# Altium project PCB_Project_IGNIS-v5.PrjPcb
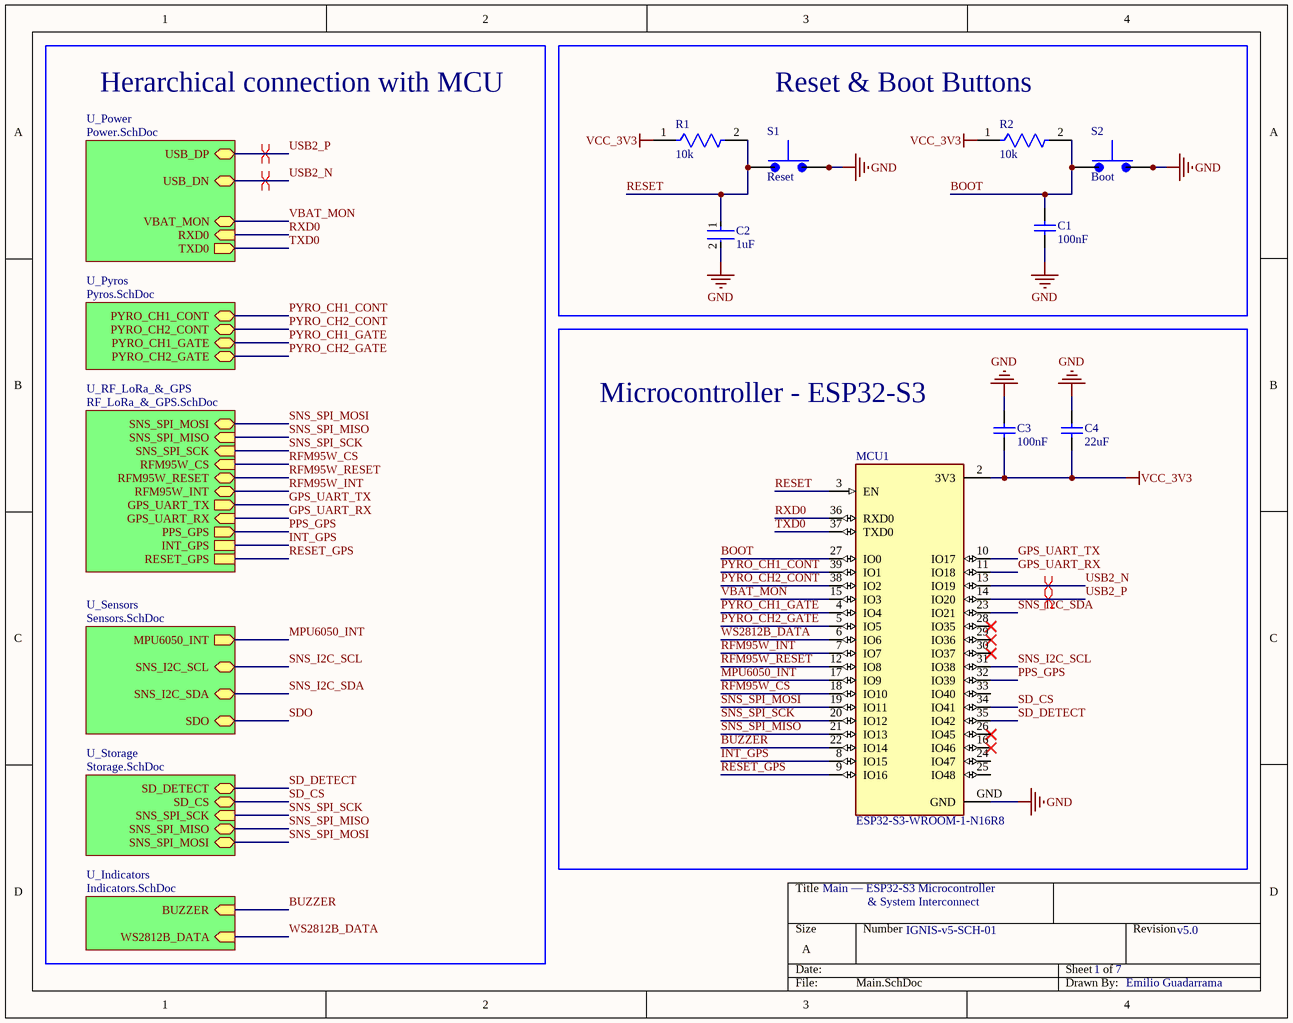
[diagram p0: Main.SchDoc]
7 sheets, 104 parts. Net scope: hierarchical (ports join the sheet entries above them; power ports are global).
Board file: PCB_IGNIS-v5.PcbDoc
Sheets:
  Main.SchDoc
    U_Pyros = Pyros.SchDoc
    U_Storage = Storage.SchDoc
    U_Indicators = Indicators.SchDoc
    U_RF_LoRa_&_GPS = RF_LoRa_&_GPS.SchDoc
    U_Power = Power.SchDoc
    U_Sensors = Sensors.SchDoc

## Sheet Main.SchDoc: Main — ESP32-S3 Microcontroller & System Interconnect
size A; DrawnBy: Emilio Guadarrama; SheetNumber: 1; SheetTotal: 7

### Parts
C1  100nF  [CAPC2013X145X50NL20T25]
C2  1uF  [FP-0805-L_2_01_0_2-W_1_25-MFG]
C3  100nF  [CAPC2013X145X50NL20T25]
C4  22uF  [CAPC0805(2012)145_L]
MCU1  ESP32-S3-WROOM-1-N16R8  [XCVR_ESP32-S3-WROOM-1-N16R2]
R1  10k  [FP-MCT0603-IPC_A]
R2  10k  [FP-MCT0603-IPC_A]
S1  Reset  [SW_SKRPABE010]
S2  Boot  [SW_SKRPABE010]

### Blocks framed on the sheet
Reset & Boot Buttons: C1 C2 R1 R2 S1 S2
Microcontroller - ESP32-S3: C3 C4 MCU1

### Sub-sheets
U_Indicators = Indicators.SchDoc: BUZZER (in), WS2812B_DATA (in)
U_Power = Power.SchDoc: RXD0 (in), TXD0 (out), VBAT_MON (bidir), USB_DP (bidir), USB_DN (bidir)
U_Pyros = Pyros.SchDoc: PYRO_CH2_CONT (bidir), PYRO_CH1_CONT (bidir), PYRO_CH2_GATE (bidir), PYRO_CH1_GATE (bidir)
U_RF_LoRa_&_GPS = RF_LoRa_&_GPS.SchDoc: SNS_SPI_MOSI (bidir), SNS_SPI_MISO (in), SNS_SPI_SCK (in), RFM95W_CS (in), RFM95W_RESET (bidir), RFM95W_INT (bidir), GPS_UART_TX (out), GPS_UART_RX (in), PPS_GPS (out), INT_GPS, RESET_GPS
U_Sensors = Sensors.SchDoc: MPU6050_INT (out), SNS_I2C_SCL (bidir), SNS_I2C_SDA (bidir), SDO (bidir)
U_Storage = Storage.SchDoc: SD_CS (bidir), SD_DETECT (bidir), SNS_SPI_MOSI (bidir), SNS_SPI_MISO (bidir), SNS_SPI_SCK (in)

### Nets
GND: C1.1 C2.2 C3.2 C4.2 MCU1.GND S1.3 S1.4 S2.3 S2.4
VCC_3V3: C3.1 C4.1 MCU1.2(3V3) R1.1 R2.1
BOOT: C1.2 MCU1.27(IO0) R2.2 S2.1 S2.2
BUZZER: MCU1.22(IO14) ; sheet U_Indicators/BUZZER
GPS_UART_RX: MCU1.11(IO18) ; sheet U_RF_LoRa_&_GPS/GPS_UART_RX
GPS_UART_TX: MCU1.10(IO17) ; sheet U_RF_LoRa_&_GPS/GPS_UART_TX
INT_GPS: MCU1.8(IO15) ; sheet U_RF_LoRa_&_GPS/INT_GPS
MPU6050_INT: MCU1.17(IO9) ; sheet U_Sensors/MPU6050_INT
PPS_GPS: MCU1.32(IO39) ; sheet U_RF_LoRa_&_GPS/PPS_GPS
PYRO_CH1_CONT: MCU1.39(IO1) ; sheet U_Pyros/PYRO_CH1_CONT
PYRO_CH1_GATE: MCU1.4(IO4) ; sheet U_Pyros/PYRO_CH1_GATE
PYRO_CH2_CONT: MCU1.38(IO2) ; sheet U_Pyros/PYRO_CH2_CONT
PYRO_CH2_GATE: MCU1.5(IO5) ; sheet U_Pyros/PYRO_CH2_GATE
RESET: C2.1 MCU1.3(EN) R1.2 S1.1 S1.2
RESET_GPS: MCU1.9(IO16) ; sheet U_RF_LoRa_&_GPS/RESET_GPS
RFM95W_CS: MCU1.18(IO10) ; sheet U_RF_LoRa_&_GPS/RFM95W_CS
RFM95W_INT: MCU1.7(IO7) ; sheet U_RF_LoRa_&_GPS/RFM95W_INT
RFM95W_RESET: MCU1.12(IO8) ; sheet U_RF_LoRa_&_GPS/RFM95W_RESET
RXD0: MCU1.36(RXD0) ; sheet U_Power/RXD0
SD_CS: MCU1.34(IO41) ; sheet U_Storage/SD_CS
SD_DETECT: MCU1.35(IO42) ; sheet U_Storage/SD_DETECT
SDO: sheet U_Sensors/SDO
SNS_I2C_SCL: MCU1.31(IO38) ; sheet U_Sensors/SNS_I2C_SCL
SNS_I2C_SDA: MCU1.23(IO21) ; sheet U_Sensors/SNS_I2C_SDA
SNS_SPI_MISO: MCU1.21(IO13) ; sheet U_Storage/SNS_SPI_MISO, sheet U_RF_LoRa_&_GPS/SNS_SPI_MISO
SNS_SPI_MOSI: MCU1.19(IO11) ; sheet U_Storage/SNS_SPI_MOSI, sheet U_RF_LoRa_&_GPS/SNS_SPI_MOSI
SNS_SPI_SCK: MCU1.20(IO12) ; sheet U_Storage/SNS_SPI_SCK, sheet U_RF_LoRa_&_GPS/SNS_SPI_SCK
TXD0: MCU1.37(TXD0) ; sheet U_Power/TXD0
USB2_N: MCU1.13(IO19) ; sheet U_Power/USB_DN
USB2_P: MCU1.14(IO20) ; sheet U_Power/USB_DP
VBAT_MON: MCU1.15(IO3) ; sheet U_Power/VBAT_MON
WS2812B_DATA: MCU1.6(IO6) ; sheet U_Indicators/WS2812B_DATA

Not connected (* = marked no-connect by the designer): MCU1 16(IO46)* 24(IO47) 25(IO48) 26(IO45)* 28(IO35)* 29(IO36)* 30(IO37)* 33(IO40)

### Layout directives
differential pair: USB2_N, USB2_P

### Notes on the sheet
- Herarchical connection with MCU
- Main — ESP32-S3 Microcontroller
- & System Interconnect
- IGNIS-v5-SCH-01
- 1
- 7
- v5.0
- Emilio Guadarrama

### Library data of the parts
C1 C3 = CMP-2007-01227-1: Manufacturer: Kemet; Part Number: C0805S104K5RACTU
C2 = CMP-07738-122049624-1: 08051C105K4T2A Cap Ceramic 1uF 100V X7R 10% Pad SMD 0805 125C Automotive T/R; Capacitance: 1µF; Tolerance: 10%; Dielectric: X7R; Case/Package: 0805; Material: Ceramic; Height: 1.4mm; Voltage Rating (DC): 100V; Voltage Rating: 100V; Schedule B: 8532240020; NexarPartId: 122049624; RoHS: Compliant; Lifecycle Status: Production; Min Operating Temperature: -55°C; Max Operating Temperature: 125°C
C4 = CMP-1036-04938-1: CAP 22uF 6.3V ±10% 0805 (2012 Metric) Thickness 1.45mm SMD; Tolerance: Â±10%; Case-EIA: 0805; Case-Metric: 2012; Technology: SMT; Rated Voltage: 6.3 V; Max Thickness: 1.45 mm; Value: 22uF
MCU1 = ESP32-S3-WROOM-1-N16R8: Bluetooth, WiFi 802.11b/g/n, Bluetooth v5.0 Transceiver Module 2.4GHz PCB Trace Surface Mount; MF: Espressif Systems; MP: ESP32S3WROOM1N16R2; SnapEDA_Link: https://www.snapeda.com/parts/ESP32S3WROOM1N16R2/Espressif+Systems/view-part/?ref=snap; Package: NON STANDARD Espressif Systems; Value: *; Check_prices: https://www.snapeda.com/parts/ESP32S3WROOM1N16R2/Espressif+Systems/view-part/?ref=eda
R1 R2 = CMP-02407-011165-1: RES SMD 100 OHM 1% 1/8W 0603; Temperature Coefficient: 25ppm/°C; Resistance: 10kR; Power Rating: 125mW; Tolerance: 0.1%; Voltage Rating: 75V; Length: 1.55mm; Case Code (Imperial): 0603; Case/Package: 0603; Construction: Rectangular; Package Quantity: 1000; Number of Terminations: 2; Termination: SMD/SMT; Resistor Type: Thin Film; Features: Automotive AEC-Q200; Series: MCT 0603 - Precision; Max Operating Temperature: 155°C; Depth: 0.85mm; Max Power Dissipation: 125mW; Min Operating Temperature: -55°C; Width: 0.033inch; Case Code (Metric): 1608; Packaging: Tape and Reel; Weight: 6.7E-05oz; Military Standard: Not; Height: 0.022inch
S1 S2 = SKRPABE010: Switch Tactile N.O. SPST Button J-Bend 0.05A 16VDC 1.57N SMD Automotive T/R; MF: ALPS; SnapEDA_Link: https://www.snapeda.com/parts/SKRPABE010/ALPS/view-part/?ref=snap; Package: None; Value: *; MP: SKRPABE010; Check_prices: https://www.snapeda.com/parts/SKRPABE010/ALPS/view-part/?ref=eda

## Sheet Pyros.SchDoc
size A; SheetNumber: 7; SheetTotal: 7
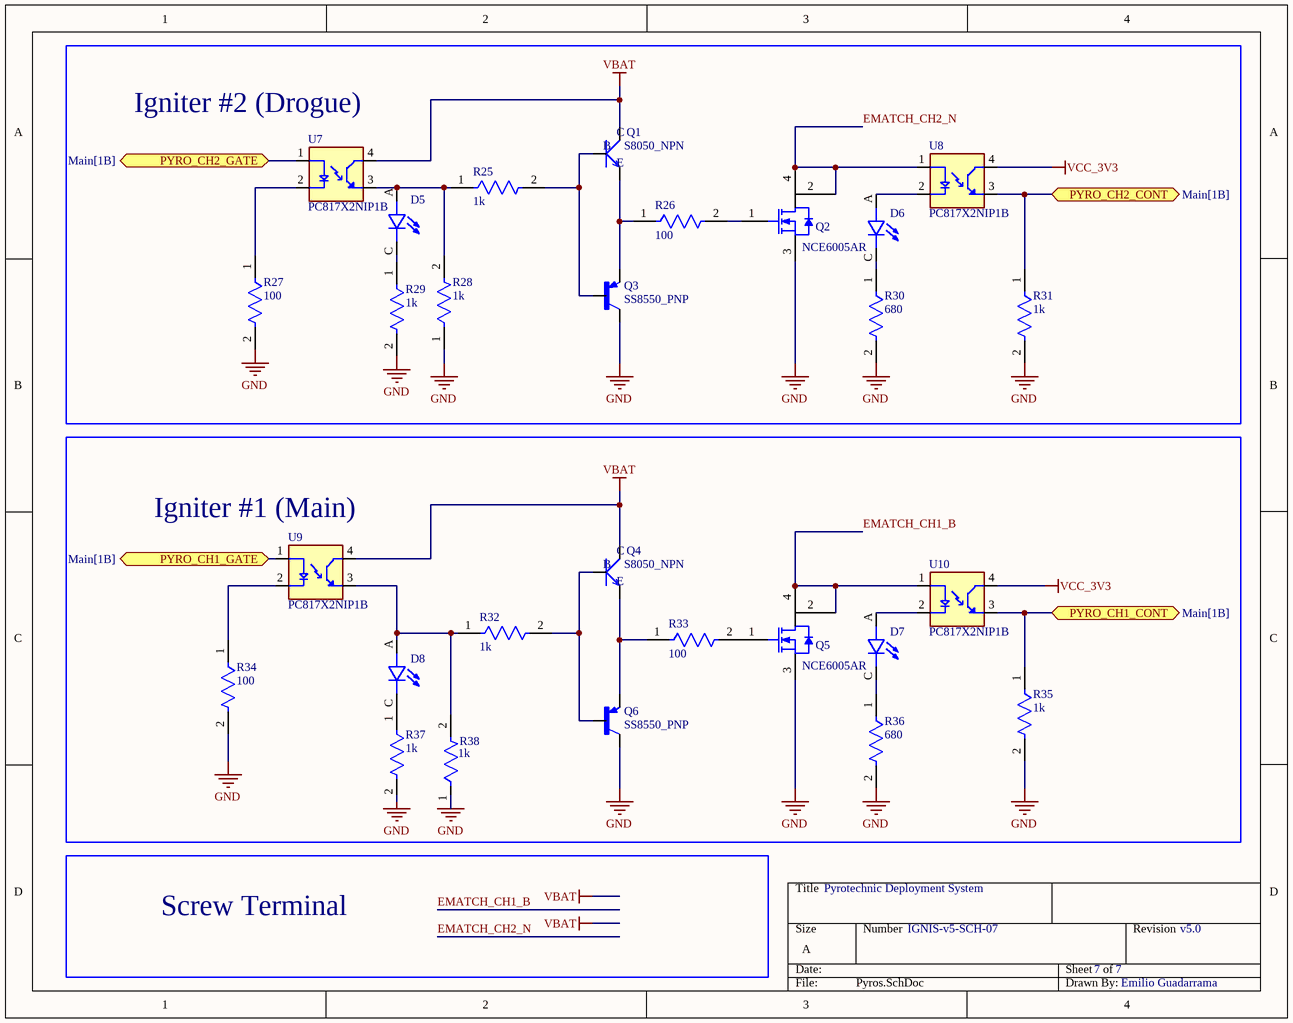
[diagram p1: Pyros.SchDoc]

### Parts
D5  SML-LXT0805IW-TR  [LEDC2012X120N]  (value not drawn)
D6  SML-LXT0805IW-TR  [LEDC2012X120N]  (value not drawn)
D7  SML-LXT0805IW-TR  [LEDC2012X120N]  (value not drawn)
D8  SML-LXT0805IW-TR  [LEDC2012X120N]  (value not drawn)
Q1  S8050_NPN  [SOT-23]
Q2  NCE6005AR  [PCBComponent_1]
Q3  SS8550_PNP  [SOT95P252X140-3N]
Q4  S8050_NPN  [SOT-23]
Q5  NCE6005AR  [PCBComponent_1]
Q6  SS8550_PNP  [SOT95P252X140-3N]
R25  1k  [FP-MCT0603-IPC_A]
R26  100  [FP-MCT0603-IPC_A]
R27  100  [FP-MCT0603-IPC_A]
R28  1k  [FP-MCT0603-IPC_A]
R29  1k  [FP-MCT0603-IPC_A]
R30  680  [FP-MCT0603-IPC_A]
R31  1k  [FP-MCT0603-IPC_A]
R32  1k  [FP-MCT0603-IPC_A]
R33  100  [FP-MCT0603-IPC_A]
R34  100  [FP-MCT0603-IPC_A]
R35  1k  [FP-MCT0603-IPC_A]
R36  680  [FP-MCT0603-IPC_A]
R37  1k  [FP-MCT0603-IPC_A]
R38  1k  [FP-MCT0603-IPC_A]
U7  PC817X2NIP1B  [SOIC254P960X420-4N]
U8  PC817X2NIP1B  [SOIC254P960X420-4N]
U9  PC817X2NIP1B  [SOIC254P960X420-4N]
U10  PC817X2NIP1B  [SOIC254P960X420-4N]

### Blocks framed on the sheet
Igniter #2 (Drogue): D5 D6 Q1-Q3 R25-R31 U7 U8
Igniter #1 (Main): D7 D8 Q4-Q6 R32-R38 U9 U10

### Ports
PYRO_CH1_CONT (bidir, see Main[1B]), PYRO_CH1_GATE (bidir, see Main[1B]), PYRO_CH2_CONT (bidir, see Main[1B]), PYRO_CH2_GATE (bidir, see Main[1B])

### Nets
GND: Q2.3(S) Q3.3(C) Q5.3(S) Q6.3(C) R27.2 R28.1 R29.2 R30.2 R31.2 R34.2 R35.2 R36.2 R37.2 R38.1
VBAT: Q1.3(C) Q4.3(C) U7.4(CT) U9.4(CT)
VCC_3V3: U8.4(CT) U10.4(CT)
EMATCH_CH1_B: Q5.2(D) Q5.4(D) U10.1(A)
EMATCH_CH2_N: Q2.2(D) Q2.4(D) U8.1(A)
PYRO_CH1_CONT: R35.1 U10.3(ET) ; port PYRO_CH1_CONT
PYRO_CH1_GATE: U9.1(A) ; port PYRO_CH1_GATE
PYRO_CH2_CONT: R31.1 U8.3(ET) ; port PYRO_CH2_CONT
PYRO_CH2_GATE: U7.1(A) ; port PYRO_CH2_GATE
NetD5_A: D5.A R25.1 R28.2 U7.3(ET)
NetD5_C: D5.C R29.1
NetD6_A: D6.A U8.2(C)
NetD6_C: D6.C R30.1
NetD7_A: D7.A U10.2(C)
NetD7_C: D7.C R36.1
NetD8_A: D8.A R32.1 R38.2 U9.3(ET)
NetD8_C: D8.C R37.1
NetQ1_1: Q1.1(B) Q3.1(B) R25.2
NetQ1_2: Q1.2(E) Q3.2(E) R26.1
NetQ2_1: Q2.1(G) R26.2
NetQ4_1: Q4.1(B) Q6.1(B) R32.2
NetQ4_2: Q4.2(E) Q6.2(E) R33.1
NetQ5_1: Q5.1(G) R33.2
NetR27_1: R27.1 U7.2(C)
NetR34_1: R34.1 U9.2(C)

### Notes on the sheet
- Pyrotechnic Deployment System
- Screw Terminal
- IGNIS-v5-SCH-07
- 7
- v5.0
- Emilio Guadarrama

### Library data of the parts
D5-D8 = SML-LXT0805IW-TR: LED;Red;11mcd;0.061In.Dia.;SMD;100mA;2V Vf;635nm;140deg;SMD;White Diffused;5V Vr | Lumex SML-LXT0805IW-TR; MF: Lumex Opto/Components; SnapEDA_Link: https://www.snapeda.com/parts/SML-LXT0805IW-TR/Lumex+Opto%252FComponents+Inc./view-part/?ref=snap; Package: 0805 Lumex; Value: *; MP: SML-LXT0805IW-TR; Check_prices: https://www.snapeda.com/parts/SML-LXT0805IW-TR/Lumex+Opto%252FComponents+Inc./view-part/?ref=eda
Q1 Q4 = SMD-TRANSISTORS-NPN-25V-500MW(SOT-23): Bipolar (BJT) Transistor NPN 25 V 500 mA 150MHz 300 mW Surface Mount SOT-23; MF: UMW; MP: S8050; Purchase-URL: https://pricing.snapeda.com/search/part/S8050/?ref=eda; Check_prices: https://www.snapeda.com/parts/S8050/Umwelt+Sensor+Teknik/view-part/?ref=eda; SnapEDA_Link: https://www.snapeda.com/parts/S8050/Umwelt+Sensor+Teknik/view-part/?ref=snap; Price: None; Availability: In Stock; Package: None; Value: *
Q3 Q6 = SS8550: Bipolar (BJT) Transistor PNP 25 V 1.5 A 100MHz 300 mW Surface Mount SOT-23; MF: MDD; SnapEDA_Link: https://www.snapeda.com/parts/SS8550/MDD/view-part/?ref=snap; Package: SOT-23-3 MDD; Value: *; MP: SS8550; Check_prices: https://www.snapeda.com/parts/SS8550/MDD/view-part/?ref=eda
R25 R28 R31 R32 R35 R38 = CMP-02407-011165-1: RES SMD 100 OHM 1% 1/8W 0603; Temperature Coefficient: 25ppm/°C; Resistance: 1kR; Power Rating: 125mW; Tolerance: 0.1%; Voltage Rating: 75V; Length: 1.55mm; Case Code (Imperial): 0603; Case/Package: 0603; Construction: Rectangular; Package Quantity: 1000; Number of Terminations: 2; Termination: SMD/SMT; Resistor Type: Thin Film; Features: Automotive AEC-Q200; Series: MCT 0603 - Precision; Max Operating Temperature: 155°C; Depth: 0.85mm; Max Power Dissipation: 125mW; Min Operating Temperature: -55°C; Width: 0.033inch; Case Code (Metric): 1608; Packaging: Tape and Reel; Weight: 6.7E-05oz; Military Standard: Not; Height: 0.022inch
R26 R33 = CMP-02407-011165-1: RES SMD 100 OHM 1% 1/8W 0603; Temperature Coefficient: 25ppm/°C; Resistance: 100R; Power Rating: 125mW; Tolerance: 0.1%; Voltage Rating: 75V; Length: 1.55mm; Case Code (Imperial): 0603; Case/Package: 0603; Construction: Rectangular; Package Quantity: 1000; Number of Terminations: 2; Termination: SMD/SMT; Resistor Type: Thin Film; Features: Automotive AEC-Q200; Series: MCT 0603 - Precision; Max Operating Temperature: 155°C; Depth: 0.85mm; Max Power Dissipation: 125mW; Min Operating Temperature: -55°C; Width: 0.033inch; Case Code (Metric): 1608; Packaging: Tape and Reel; Weight: 6.7E-05oz; Military Standard: Not; Height: 0.022inch
R27 R29 R34 R37 = CMP-02407-011165-1: RES SMD 100 OHM 1% 1/8W 0603; Temperature Coefficient: 25ppm/°C; Resistance: 150R; Power Rating: 125mW; Tolerance: 0.1%; Voltage Rating: 75V; Length: 1.55mm; Case Code (Imperial): 0603; Case/Package: 0603; Construction: Rectangular; Package Quantity: 1000; Number of Terminations: 2; Termination: SMD/SMT; Resistor Type: Thin Film; Features: Automotive AEC-Q200; Series: MCT 0603 - Precision; Max Operating Temperature: 155°C; Depth: 0.85mm; Max Power Dissipation: 125mW; Min Operating Temperature: -55°C; Width: 0.033inch; Case Code (Metric): 1608; Packaging: Tape and Reel; Weight: 6.7E-05oz; Military Standard: Not; Height: 0.022inch
R30 R36 = CMP-02407-011165-1: RES SMD 100 OHM 1% 1/8W 0603; Temperature Coefficient: 25ppm/°C; Resistance: 680R; Power Rating: 125mW; Tolerance: 0.1%; Voltage Rating: 75V; Length: 1.55mm; Case Code (Imperial): 0603; Case/Package: 0603; Construction: Rectangular; Package Quantity: 1000; Number of Terminations: 2; Termination: SMD/SMT; Resistor Type: Thin Film; Features: Automotive AEC-Q200; Series: MCT 0603 - Precision; Max Operating Temperature: 155°C; Depth: 0.85mm; Max Power Dissipation: 125mW; Min Operating Temperature: -55°C; Width: 0.033inch; Case Code (Metric): 1608; Packaging: Tape and Reel; Weight: 6.7E-05oz; Military Standard: Not; Height: 0.022inch
U7-U10 = PC817X2NIP1B: Optocoupler DC-IN 1-CH Transistor DC-OUT 4-Pin DIP SMD T/R; MF: Sharp Microelectronics; SnapEDA_Link: https://www.snapeda.com/parts/PC817X2NIP1B/Sharp+Microelectronics/view-part/?ref=snap; Package: SMD-4 Sharp Microelectronics; Value: *; MP: PC817X2NIP1B; Check_prices: https://www.snapeda.com/parts/PC817X2NIP1B/Sharp+Microelectronics/view-part/?ref=eda

## Sheet Storage.SchDoc
size A; SheetNumber: 5; SheetTotal: 7
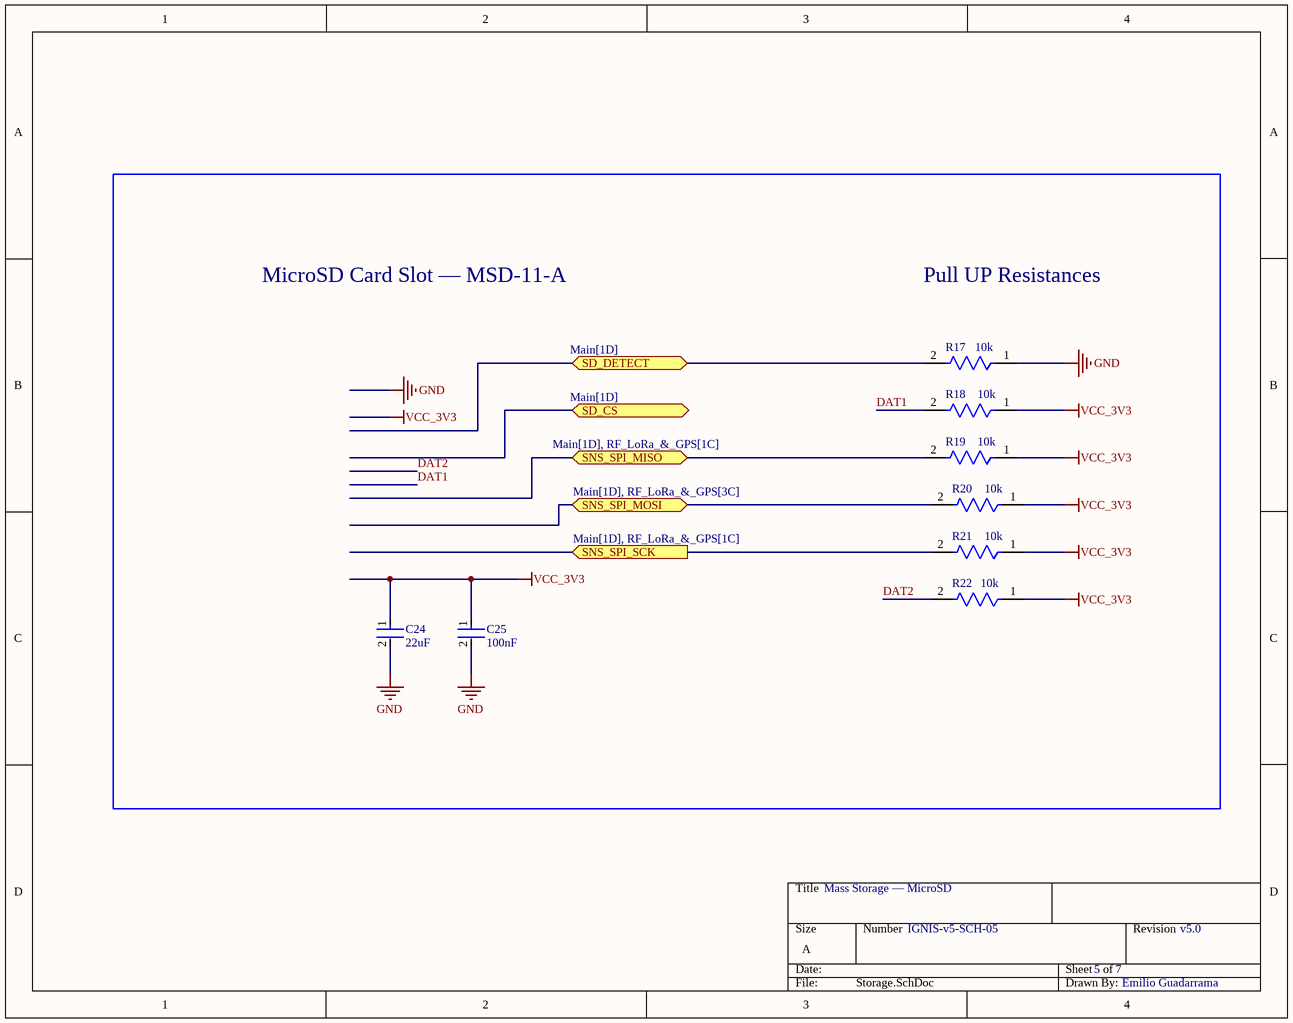
[diagram p2: Storage.SchDoc]

### Parts
C24  22uF  [FP-C0805C-DN-MFG]
C25  100nF  [FP-C0805C-DN-MFG]
R17  10k  [FP-MCT0603-IPC_A]
R18  10k  [FP-MCT0603-IPC_A]
R19  10k  [FP-MCT0603-IPC_A]
R20  10k  [FP-MCT0603-IPC_A]
R21  10k  [FP-MCT0603-IPC_A]
R22  10k  [FP-MCT0603-IPC_A]

### Ports
SD_CS (bidir, see Main[1D]), SD_DETECT (bidir, see Main[1D]), SNS_SPI_MISO (bidir, see Main[1D], RF_LoRa_&_GPS[1C]), SNS_SPI_MOSI (bidir, see Main[1D], RF_LoRa_&_GPS[3C]), SNS_SPI_SCK (in, see Main[1D], RF_LoRa_&_GPS[1C])

### Nets
GND: C24.2 C25.2 R17.1
VCC_3V3: C24.1 C25.1 R18.1 R19.1 R20.1 R21.1 R22.1
DAT1: R18.2
DAT2: R22.2
SD_DETECT: R17.2 ; port SD_DETECT
SNS_SPI_MISO: R19.2 ; port SNS_SPI_MISO
SNS_SPI_MOSI: R20.2 ; port SNS_SPI_MOSI
SNS_SPI_SCK: R21.2 ; port SNS_SPI_SCK

### Notes on the sheet
- MicroSD Card Slot — MSD-11-A
- Pull UP Resistances
- Mass Storage — MicroSD
- IGNIS-v5-SCH-05
- 5
- 7
- v5.0
- Emilio Guadarrama

### Library data of the parts
C24 C25 = CMP-2007-00279-2: CAP CER 0.1UF 50V X7R 0805; Manufacturer Part Number: C0805C104K5RACTU; Manufacturer: KEMET; Tolerance: 0.1; Temperature Coefficient: 30ppm/°C; Material: Ceramic; Device Class L2: Capacitors; Temperature Range Low: -55°C; Voltage Rating: 50 V; Digikey Description: CAP CER 0.1UF 50V X7R 0805; Category: Cap; ComponentLink2Description: Datasheet; Octopart: https://octopart.com/c0805c104k5ractu-kemet-143926; RoHS: TRUE; ComponentLink2URL: https://content.kemet.com/datasheets/KEM_C1003_C0G_SMD.pdf; Temperature Characteristic: X7R; Temperature: -55°C to +125°C; Height: 0.88mm; Temperature Range High: +125°C; Device Class L1: Passive Components; Automotive: No; Lead Free: Yes; Ipc Land Pattern Name: CAPC200125X78; Device Class L3: Ceramic Capacitors; Mouser Description: Cap Ceramic 0.1uF 50V X7R 10% SMD 2.0 x 1.2 mm 125 C Paper T/R; Package: C0805C-DN
  C24: Value: 22 uF; Capacitance: 22 uF
  C25: Value: 100 nF; Capacitance: 100 nF
R17-R22 = CMP-02407-011165-1: as R1 on sheet Main; Length: 1.55mm; Case Code (Imperial): 0603; Case/Package: 0603; Construction: Rectangular; Package Quantity: 1000; Number of Terminations: 2; Termination: SMD/SMT; Resistor Type: Thin Film; Features: Automotive AEC-Q200; Series: MCT 0603 - Precision; Max Operating Temperature: 155°C; Depth: 0.85mm; Max Power Dissipation: 125mW; Min Operating Temperature: -55°C; Width: 0.033inch; Case Code (Metric): 1608; Packaging: Tape and Reel; Weight: 6.7E-05oz; Military Standard: Not; Height: 0.022inch

## Sheet Indicators.SchDoc
size A; SheetNumber: 6; SheetTotal: 7
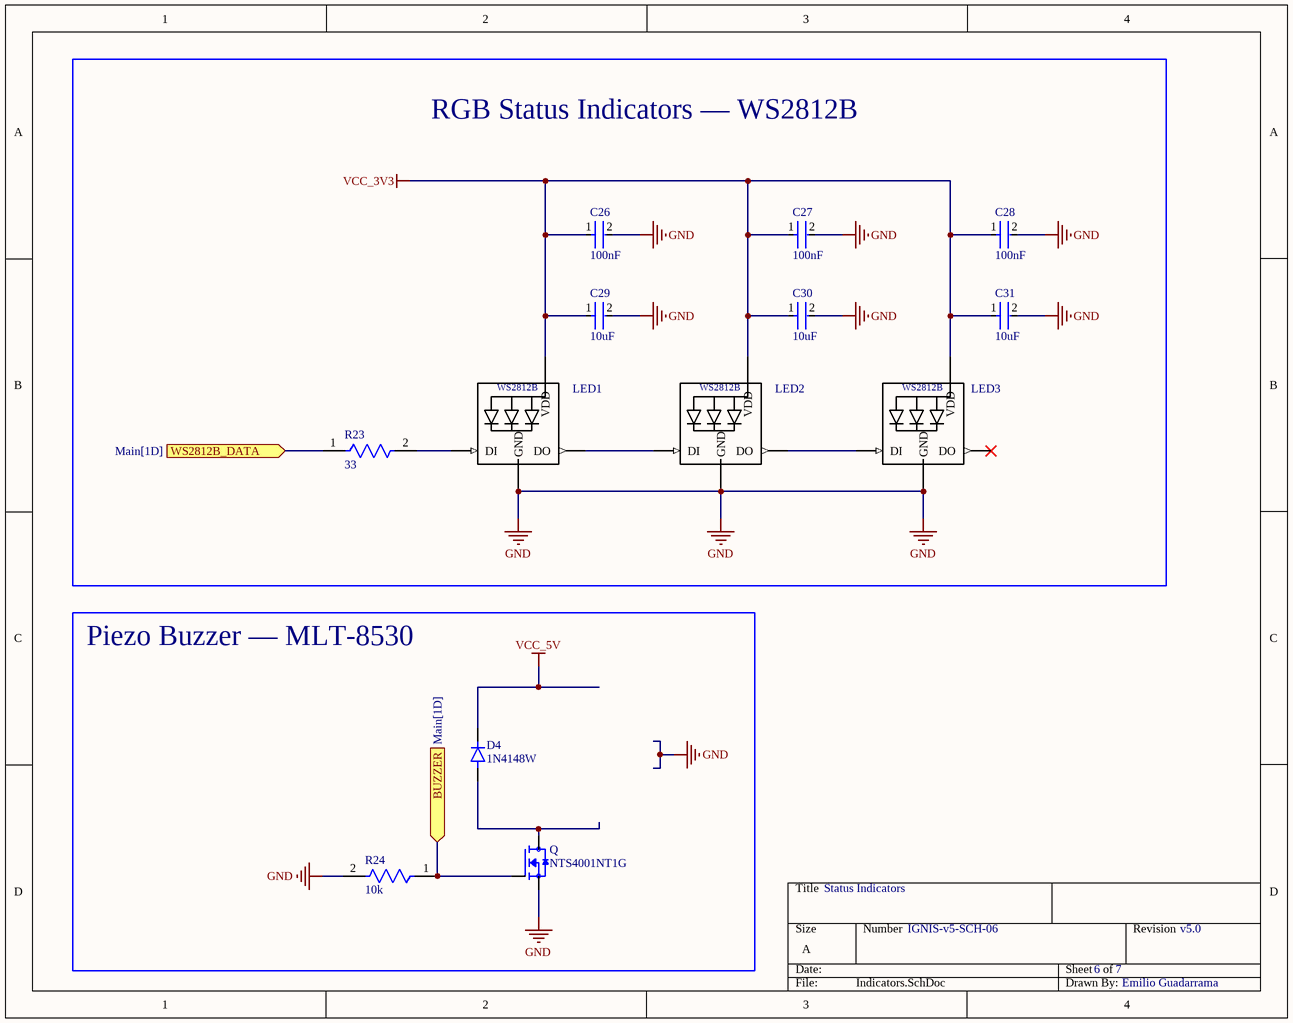
[diagram p3: Indicators.SchDoc]

### Parts
C26  100nF  [FP-C0805C-DN-MFG]
C27  100nF  [FP-C0805C-DN-MFG]
C28  100nF  [FP-C0805C-DN-MFG]
C29  10uF  [FP-C0805C-DN-MFG]
C30  10uF  [FP-C0805C-DN-MFG]
C31  10uF  [FP-C0805C-DN-MFG]
D4  1N4148W  [SODFL3816X120N]
LED1  WS2812B  [*LED3535]  (value not drawn)
LED2  WS2812B  [*LED3535]  (value not drawn)
LED3  WS2812B  [*LED3535]  (value not drawn)
Q  NTS4001NT1G  [SOT65P220X100-3N]
R23  33  [FP-MCT0603-IPC_A]
R24  10k  [FP-MCT0603-IPC_A]

### Blocks framed on the sheet
RGB Status Indicators — WS2812B: C26-C31 LED1-LED3 R23
Piezo Buzzer — MLT-8530: D4 Q R24

### Ports
BUZZER (in, see Main[1D]), WS2812B_DATA (in, see Main[1D])

### Nets
GND: C26.2 C27.2 C28.2 C29.2 C30.2 C31.2 LED1.3(GND) LED2.3(GND) LED3.3(GND) Q.2(S) R24.2
VCC_3V3: C26.1 C27.1 C28.1 C29.1 C30.1 C31.1 LED1.1(VDD) LED2.1(VDD) LED3.1(VDD)
VCC_5V: D4.C(K)
BUZZER: Q.1(G) R24.1 ; port BUZZER
WS2812B_DATA: R23.1 ; port WS2812B_DATA
NetD4_A: D4.A Q.3(D)
NetLED1_2: LED1.2(DO) LED2.4(DI)
NetLED1_4: LED1.4(DI) R23.2
NetLED2_2: LED2.2(DO) LED3.4(DI)

Not connected (* = marked no-connect by the designer): LED3 2(DO)*

### Notes on the sheet
- Status Indicators
- IGNIS-v5-SCH-06
- 6
- 7
- v5.0
- Emilio Guadarrama

### Library data of the parts
C26-C31 = CMP-2007-00279-2: as C24 on sheet Storage; Device Class L2: Capacitors; Temperature Range Low: -55°C; Voltage Rating: 50 V; Digikey Description: CAP CER 0.1UF 50V X7R 0805; Category: Cap; ComponentLink2Description: Datasheet; Octopart: https://octopart.com/c0805c104k5ractu-kemet-143926; RoHS: TRUE; ComponentLink2URL: https://content.kemet.com/datasheets/KEM_C1003_C0G_SMD.pdf; Temperature Characteristic: X7R; Temperature: -55°C to +125°C; Height: 0.88mm; Temperature Range High: +125°C; Device Class L1: Passive Components; Automotive: No; Lead Free: Yes; Ipc Land Pattern Name: CAPC200125X78; Device Class L3: Ceramic Capacitors; Mouser Description: Cap Ceramic 0.1uF 50V X7R 10% SMD 2.0 x 1.2 mm 125 C Paper T/R; Package: C0805C-DN
  C26-C28: Value: 100 nF; Capacitance: 100 nF
  C29-C31: Value: 10 uF; Capacitance: 10 uF
D4 = 1N4148W: Small Signal Diode, SOD-123F, 100V, 0.15A, 150Â°C; MF: Diotec Semiconductor; SnapEDA_Link: https://www.snapeda.com/parts/1N4148W/Diotec/view-part/?ref=snap; Package: SOD-123F Diotec; Value: *; MP: 1N4148W; Check_prices: https://www.snapeda.com/parts/1N4148W/Diotec/view-part/?ref=eda
LED1-LED3 = WS2812B: Intelligent control LED integrated light source; MF: Worldsemi; SnapEDA_Link: https://www.snapeda.com/parts/WS2812B/Worldsemi/view-part/?ref=snap; Package: None; MP: WS2812B; Check_prices: https://www.snapeda.com/parts/WS2812B/Worldsemi/view-part/?ref=eda; Value: *
Q = NTS4001NT1G: N-Channel 30V 270mA _Ta_ 330mW _Ta_ Surface Mount SC-70-3 _SOT323_; MF: ON Semiconductor; Package: SC-70 ON Semiconductor; MP: NTS4001NT1G; SnapEDA_Link: https://www.snapeda.com/parts/NTS4001NT1G/ON%20Semiconductor/view-part/274588/?ref=snap; Price: None; Value: *; Availability: Unavailable
R23 = CMP-02407-011165-1: RES SMD 100 OHM 1% 1/8W 0603; Temperature Coefficient: 25ppm/°C; Resistance: 33R; Power Rating: 125mW; Tolerance: 0.1%; Voltage Rating: 75V; Length: 1.55mm; Case Code (Imperial): 0603; Case/Package: 0603; Construction: Rectangular; Package Quantity: 1000; Number of Terminations: 2; Termination: SMD/SMT; Resistor Type: Thin Film; Features: Automotive AEC-Q200; Series: MCT 0603 - Precision; Max Operating Temperature: 155°C; Depth: 0.85mm; Max Power Dissipation: 125mW; Min Operating Temperature: -55°C; Width: 0.033inch; Case Code (Metric): 1608; Packaging: Tape and Reel; Weight: 6.7E-05oz; Military Standard: Not; Height: 0.022inch
R24 = CMP-02407-011165-1: as R1 on sheet Main; Length: 1.55mm; Case Code (Imperial): 0603; Case/Package: 0603; Construction: Rectangular; Package Quantity: 1000; Number of Terminations: 2; Termination: SMD/SMT; Resistor Type: Thin Film; Features: Automotive AEC-Q200; Series: MCT 0603 - Precision; Max Operating Temperature: 155°C; Depth: 0.85mm; Max Power Dissipation: 125mW; Min Operating Temperature: -55°C; Width: 0.033inch; Case Code (Metric): 1608; Packaging: Tape and Reel; Weight: 6.7E-05oz; Military Standard: Not; Height: 0.022inch

## Sheet RF_LoRa_&_GPS.SchDoc
size A; SheetNumber: 3; SheetTotal: 7
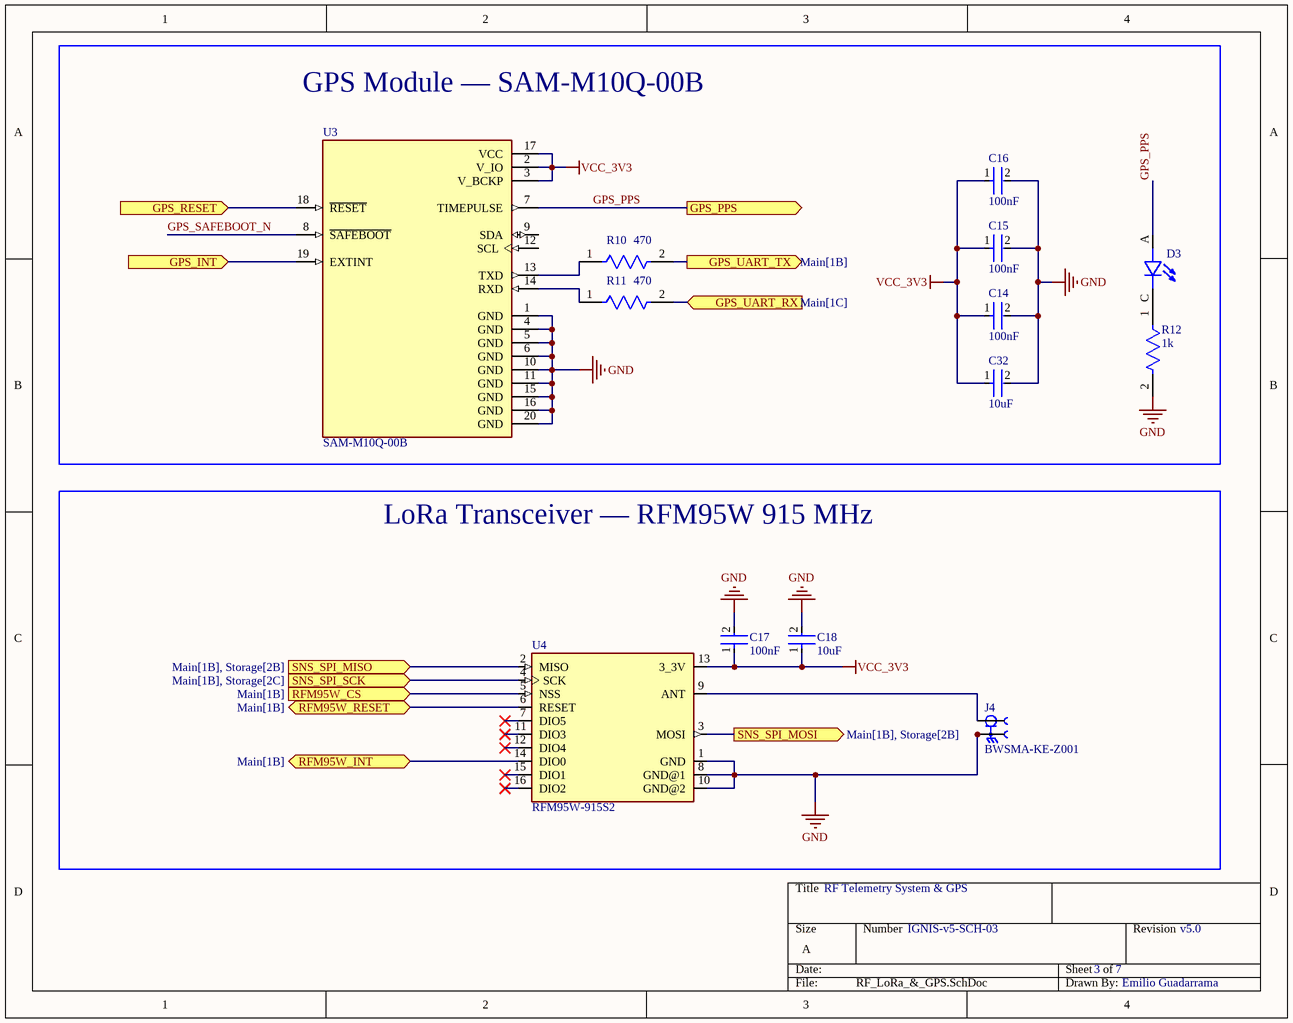
[diagram p4: RF_LoRa_&_GPS.SchDoc]

### Parts
C14  100nF  [FP-C0805C-DN-MFG]
C15  100nF  [FP-C0805C-DN-MFG]
C16  100nF  [FP-C0805C-DN-MFG]
C17  100nF  [FP-C0805C-DN-MFG]
C18  10uF  [FP-C0805C-DN-MFG]
C32  10uF  [FP-C0805C-DN-MFG]
D3  SML-LXT0805IW-TR  [LEDC2012X120N]  (value not drawn)
J4  BWSMA-KE-Z001  [BAT_WIRELESS_BWSMA-KE-Z001]
R10  470  [FP-MCT0603-IPC_A]
R11  470  [FP-MCT0603-IPC_A]
R12  1k  [FP-MCT0603-IPC_A]
U3  SAM-M10Q-00B  [XCVR_SAM-M10Q-00B]
U4  RFM95W-915S2  [XCVR_RFM95W-868S2]

### Blocks framed on the sheet
GPS Module — SAM-M10Q-00B: C14-C16 C32 D3 R10-R12 U3
LoRa Transceiver — RFM95W 915 MHz: C17 C18 J4 U4

### Ports
GPS_INT (in), GPS_PPS (out), GPS_RESET (in), GPS_UART_RX (in, see Main[1C]), GPS_UART_TX (out, see Main[1B]), RFM95W_CS (in, see Main[1B]), RFM95W_INT (bidir, see Main[1B]), RFM95W_RESET (bidir, see Main[1B]), SNS_SPI_MISO (in, see Main[1B], Storage[2B]), SNS_SPI_MOSI (out, see Main[1B], Storage[2B]), SNS_SPI_SCK (in, see Main[1B], Storage[2C])

### Nets
GND: C14.2 C15.2 C16.2 C17.2 C18.2 C32.2 J4.2_1 J4.2_2 J4.2_3 J4.2_4 R12.2 U3.1(GND) U3.4(GND) U3.5(GND) U3.6(GND) U3.10(GND) U3.11(GND) U3.15(GND) U3.16(GND) U3.20(GND) U4.1(GND) U4.8(GND@1) U4.10(GND@2)
VCC_3V3: C14.1 C15.1 C16.1 C17.1 C18.1 C32.1 U3.2(V_IO) U3.3(V_BCKP) U3.17(VCC) U4.13(3_3V)
GPS_PPS: D3.A U3.7(TIMEPULSE) ; port GPS_PPS
GPS_SAFEBOOT_N: U3.8(~{SAFEBOOT})
GPS_UART_RX: R11.2 ; port GPS_UART_RX
GPS_UART_TX: R10.2 ; port GPS_UART_TX
RFM95W_CS: U4.5(NSS) ; port RFM95W_CS
RFM95W_INT: U4.14(DIO0) ; port RFM95W_INT
RFM95W_RESET: U4.6(RESET) ; port RFM95W_RESET
SNS_SPI_MISO: U4.2(MISO) ; port SNS_SPI_MISO
SNS_SPI_MOSI: U4.3(MOSI) ; port SNS_SPI_MOSI
SNS_SPI_SCK: U4.4(SCK) ; port SNS_SPI_SCK
NetD3_C: D3.C R12.1
NetJ4_1: J4.1 U4.9(ANT)
NetR10_1: R10.1 U3.13(TXD)
NetR11_1: R11.1 U3.14(RXD)
NetU3_18: U3.18(~{RESET}) ; port GPS_RESET
NetU3_19: U3.19(EXTINT) ; port GPS_INT

Not connected (* = marked no-connect by the designer): U3 9(SDA) 12(SCL); U4 7(DIO5)* 11(DIO3)* 12(DIO4)* 15(DIO1)* 16(DIO2)*

### Notes on the sheet
- RF Telemetry System & GPS
- IGNIS-v5-SCH-03
- 3
- 7
- v5.0
- Emilio Guadarrama

### Library data of the parts
C14-C18 = CMP-2007-00279-2: as C24 on sheet Storage; Device Class L2: Capacitors; Temperature Range Low: -55°C; Voltage Rating: 50 V; Digikey Description: CAP CER 0.1UF 50V X7R 0805; Category: Cap; ComponentLink2Description: Datasheet; Octopart: https://octopart.com/c0805c104k5ractu-kemet-143926; RoHS: TRUE; ComponentLink2URL: https://content.kemet.com/datasheets/KEM_C1003_C0G_SMD.pdf; Temperature Characteristic: X7R; Temperature: -55°C to +125°C; Height: 0.88mm; Temperature Range High: +125°C; Device Class L1: Passive Components; Automotive: No; Lead Free: Yes; Ipc Land Pattern Name: CAPC200125X78; Device Class L3: Ceramic Capacitors; Mouser Description: Cap Ceramic 0.1uF 50V X7R 10% SMD 2.0 x 1.2 mm 125 C Paper T/R; Package: C0805C-DN
  C14-C17: Value: 100 nF; Capacitance: 100 nF
  C18: Value: 10 uF; Capacitance: 10 uF
C32 = CMP-2007-00279-2: CAP CER 0.1UF 50V X7R 0805; Manufacturer Part Number: C0805C104K5RACTU; Manufacturer: KEMET; Value: 100 nF; Tolerance: 0.1; Temperature Coefficient: 30ppm/°C; Material: Ceramic; Device Class L2: Capacitors; Temperature Range Low: -55°C; Voltage Rating: 50 V; Digikey Description: CAP CER 0.1UF 50V X7R 0805; Category: Cap; ComponentLink2Description: Datasheet; Octopart: https://octopart.com/c0805c104k5ractu-kemet-143926; RoHS: TRUE; ComponentLink2URL: https://content.kemet.com/datasheets/KEM_C1003_C0G_SMD.pdf; Temperature Characteristic: X7R; Temperature: -55°C to +125°C; Height: 0.88mm; Temperature Range High: +125°C; Device Class L1: Passive Components; Automotive: No; Lead Free: Yes; Ipc Land Pattern Name: CAPC200125X78; Device Class L3: Ceramic Capacitors; Mouser Description: Cap Ceramic 0.1uF 50V X7R 10% SMD 2.0 x 1.2 mm 125 C Paper T/R; Capacitance: 100 nF; Package: C0805C-DN
D3 = SML-LXT0805IW-TR: as D5 on sheet Pyros; SnapEDA_Link: https://www.snapeda.com/parts/SML-LXT0805IW-TR/Lumex+Opto%252FComponents+Inc./view-part/?ref=snap; Package: 0805 Lumex; Value: *; MP: SML-LXT0805IW-TR; Check_prices: https://www.snapeda.com/parts/SML-LXT0805IW-TR/Lumex+Opto%252FComponents+Inc./view-part/?ref=eda
J4 = BWSMA-KE-Z001: 1 Inner bore SMA Board Edge Positive foot -65â„ƒ~+165â„ƒ 50Î© Plugin RF Connectors / Coaxial Connectors ROHS; MF: Bat Wireless; SnapEDA_Link: https://www.snapeda.com/parts/BWSMA-KE-Z001/Bat+Wireless/view-part/?ref=snap; Package: None; Value: *; MP: BWSMA-KE-Z001; Check_prices: https://www.snapeda.com/parts/BWSMA-KE-Z001/Bat+Wireless/view-part/?ref=eda
R10 R11 = CMP-02407-011165-1: RES SMD 100 OHM 1% 1/8W 0603; Temperature Coefficient: 25ppm/°C; Resistance: 470R; Power Rating: 125mW; Tolerance: 0.1%; Voltage Rating: 75V; Length: 1.55mm; Case Code (Imperial): 0603; Case/Package: 0603; Construction: Rectangular; Package Quantity: 1000; Number of Terminations: 2; Termination: SMD/SMT; Resistor Type: Thin Film; Features: Automotive AEC-Q200; Series: MCT 0603 - Precision; Max Operating Temperature: 155°C; Depth: 0.85mm; Max Power Dissipation: 125mW; Min Operating Temperature: -55°C; Width: 0.033inch; Case Code (Metric): 1608; Packaging: Tape and Reel; Weight: 6.7E-05oz; Military Standard: Not; Height: 0.022inch
R12 = CMP-02407-011165-1: as R25 on sheet Pyros; Length: 1.55mm; Case Code (Imperial): 0603; Case/Package: 0603; Construction: Rectangular; Package Quantity: 1000; Number of Terminations: 2; Termination: SMD/SMT; Resistor Type: Thin Film; Features: Automotive AEC-Q200; Series: MCT 0603 - Precision; Max Operating Temperature: 155°C; Depth: 0.85mm; Max Power Dissipation: 125mW; Min Operating Temperature: -55°C; Width: 0.033inch; Case Code (Metric): 1608; Packaging: Tape and Reel; Weight: 6.7E-05oz; Military Standard: Not; Height: 0.022inch
U3 = SAM-M10Q-00B: - RF Receiver Galileo, GLONASS, GPS 1.575GHz, 1.602GHz -165dBm 400kbps On-Board, Patch Module; MF: u-blox; SnapEDA_Link: https://www.snapeda.com/parts/SAM-M10Q-00B/u-blox/view-part/?ref=snap; Package: None; Value: *; MP: SAM-M10Q-00B; Check_prices: https://www.snapeda.com/parts/SAM-M10Q-00B/u-blox/view-part/?ref=eda
U4 = RFM95W-868S2: General ISM < 1GHz LoRa, Transceiver Module 915MHz Antenna Not Included Surface Mount; MF: RF; Package: Non Standard RF Solutions; Price: None; Check_prices: https://www.snapeda.com/parts/RFM95W-868S2/RF+Solutions/view-part/?ref=eda; Value: *; SnapEDA_Link: https://www.snapeda.com/parts/RFM95W-868S2/RF+Solutions/view-part/?ref=snap; MP: RFM95W-868S2; Availability: In Stock; Purchase-URL: https://pricing.snapeda.com/search?q=RFM95W-868S2&ref=eda

## Sheet Power.SchDoc
size A; SheetNumber: 2; SheetTotal: 7
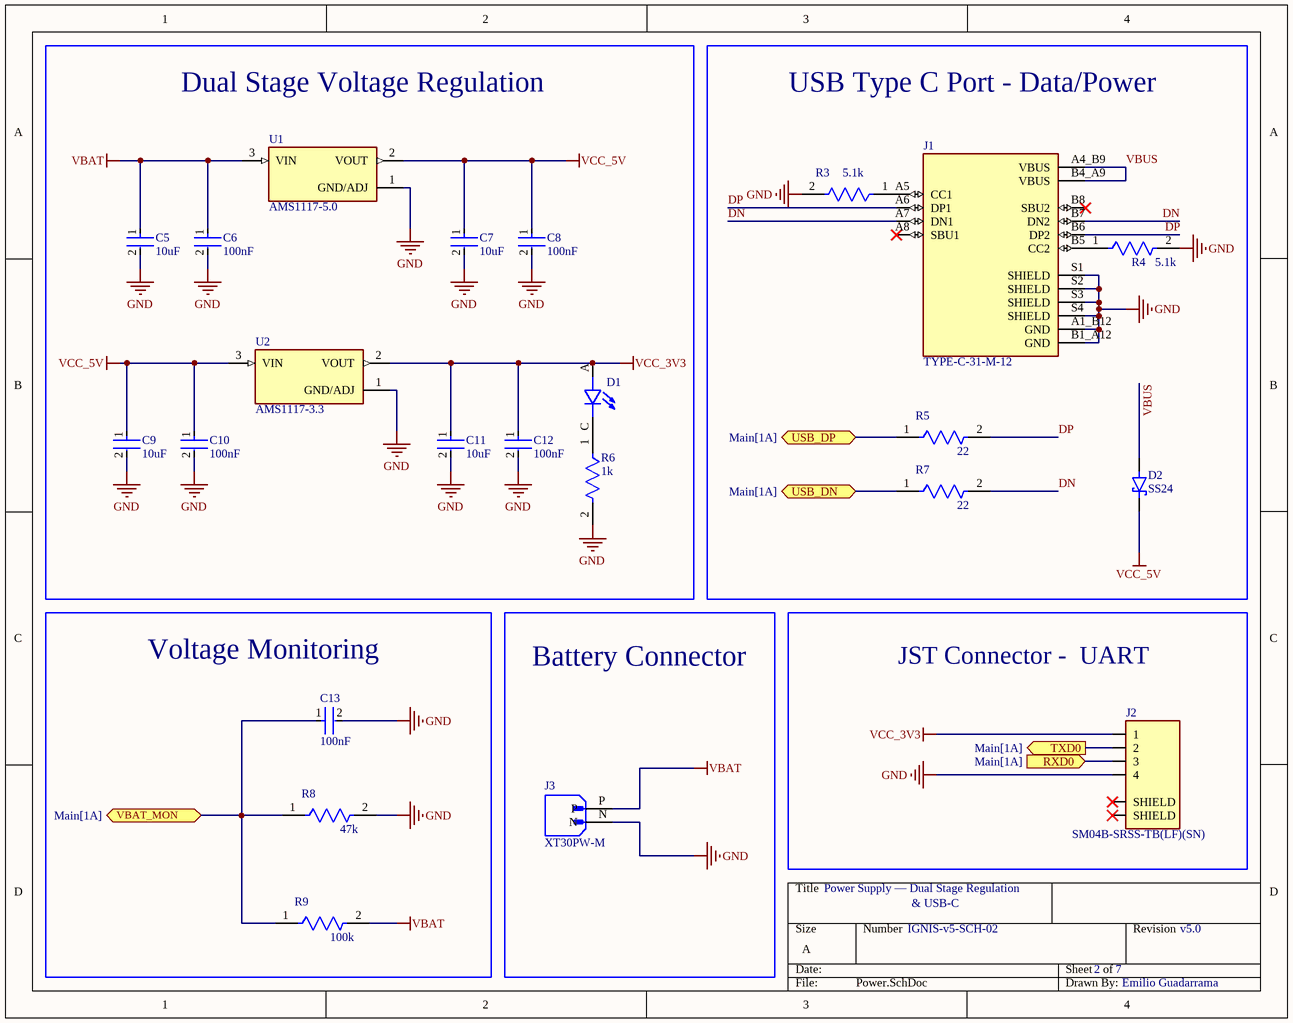
[diagram p5: Power.SchDoc]

### Parts
C5  10uF  [FP-C0805C-DN-MFG]
C6  100nF  [FP-C0805C-DN-MFG]
C7  10uF  [FP-C0805C-DN-MFG]
C8  100nF  [FP-C0805C-DN-MFG]
C9  10uF  [FP-C0805C-DN-MFG]
C10  100nF  [FP-C0805C-DN-MFG]
C11  10uF  [FP-C0805C-DN-MFG]
C12  100nF  [FP-C0805C-DN-MFG]
C13  100nF  [FP-C0805C-DN-MFG]
D1  SML-LXT0805IW-TR  [LEDC2012X120N]  (value not drawn)
D2  SS24  [DIOM4336X265N]
J1  TYPE-C-31-M-12  [HRO_TYPE-C-31-M-12]
J2  SM04B-SRSS-TB(LF)(SN)  [JST_SM04B-SRSS-TB(LF)(SN)]
J3  XT30PW-M  [AMASS_XT30PW-M]
R3  5.1k  [FP-MCT0603-IPC_A]
R4  5.1k  [FP-MCT0603-IPC_A]
R5  22  [FP-MCT0603-IPC_A]
R6  1k  [FP-MCT0603-IPC_A]
R7  22  [FP-MCT0603-IPC_A]
R8  47k  [FP-MCT0603-IPC_A]
R9  100k  [FP-MCT0603-IPC_A]
U1  AMS1117-5.0  [SOT229P700X180-4N]
U2  AMS1117-3.3  [SOT229P700X180-4N]

### Blocks framed on the sheet
Dual Stage Voltage Regulation: C5-C12 D1 R6 U1 U2
USB Type C Port - Data/Power: D2 J1 R3-R5 R7
Voltage Monitoring: C13 R8 R9
Battery Connector: J3
JST Connector -  UART: J2

### Ports
RXD0 (in, see Main[1A]), TXD0 (out, see Main[1A]), USB_DN (bidir, see Main[1A]), USB_DP (bidir, see Main[1A]), VBAT_MON (bidir, see Main[1A])

### Nets
GND: C5.2 C6.2 C7.2 C8.2 C9.2 C10.2 C11.2 C12.2 C13.2 J1.A1_B12(GND) J1.B1_A12(GND) J1.S1(SHIELD) J1.S2(SHIELD) J1.S3(SHIELD) J1.S4(SHIELD) J2.4 J3.N R3.2 R4.2 R6.2 R8.2 U1.1(GND/ADJ) U2.1(GND/ADJ)
VBAT: C5.1 C6.1 J3.P R9.2 U1.3(VIN)
VCC_3V3: C11.1 C12.1 D1.A J2.1 U2.2(VOUT)
VCC_5V: C7.1 C8.1 C9.1 C10.1 D2.C(K) U1.2(VOUT) U2.3(VIN)
DN: J1.A7(DN1) J1.B7(DN2) R7.2
DP: J1.A6(DP1) J1.B6(DP2) R5.2
RXD0: J2.3 ; port RXD0
TXD0: J2.2 ; port TXD0
USB2_N: R7.1 ; port USB_DN
USB2_P: R5.1 ; port USB_DP
VBAT_MON: C13.1 R8.1 R9.1 ; port VBAT_MON
VBUS: D2.A J1.A4_B9(VBUS) J1.B4_A9(VBUS)
NetD1_C: D1.C R6.1
NetJ1_A5: J1.A5(CC1) R3.1
NetJ1_B5: J1.B5(CC2) R4.1

Not connected (* = marked no-connect by the designer): J1 A8(SBU1)* B8(SBU2)*; J2 S1(SHIELD)* S2(SHIELD)*

### Notes on the sheet
- Power Supply — Dual Stage Regulation
- & USB-C
- IGNIS-v5-SCH-02
- 2
- 7
- v5.0
- Emilio Guadarrama

### Library data of the parts
C5-C13 = CMP-2007-00279-2: as C24 on sheet Storage; Device Class L2: Capacitors; Temperature Range Low: -55°C; Voltage Rating: 50 V; Digikey Description: CAP CER 0.1UF 50V X7R 0805; Category: Cap; ComponentLink2Description: Datasheet; Octopart: https://octopart.com/c0805c104k5ractu-kemet-143926; RoHS: TRUE; ComponentLink2URL: https://content.kemet.com/datasheets/KEM_C1003_C0G_SMD.pdf; Temperature Characteristic: X7R; Temperature: -55°C to +125°C; Height: 0.88mm; Temperature Range High: +125°C; Device Class L1: Passive Components; Automotive: No; Lead Free: Yes; Ipc Land Pattern Name: CAPC200125X78; Device Class L3: Ceramic Capacitors; Mouser Description: Cap Ceramic 0.1uF 50V X7R 10% SMD 2.0 x 1.2 mm 125 C Paper T/R; Package: C0805C-DN
  C5 C7 C9 C11: Value: 10 uF; Capacitance: 10 uF
  C6 C8 C10 C12 C13: Value: 100 nF; Capacitance: 100 nF
D1 = SML-LXT0805IW-TR: as D5 on sheet Pyros; SnapEDA_Link: https://www.snapeda.com/parts/SML-LXT0805IW-TR/Lumex+Opto%252FComponents+Inc./view-part/?ref=snap; Package: 0805 Lumex; Value: *; MP: SML-LXT0805IW-TR; Check_prices: https://www.snapeda.com/parts/SML-LXT0805IW-TR/Lumex+Opto%252FComponents+Inc./view-part/?ref=eda
D2 = SS24: 2A, 40V, Schottky Rectifier; MF: Taiwan Semiconductor; Package: SMB-2 Taiwan Semiconductor; Price: None; Value: *; SnapEDA_Link: https://www.snapeda.com/parts/SS24/Taiwan+Semiconductor/view-part/?ref=snap; MP: SS24; Availability: In Stock; Check_prices: https://www.snapeda.com/parts/SS24/Taiwan+Semiconductor/view-part/?ref=eda
J1 = TYPE-C-31-M-12: USB Connectors 24 Receptacle 1 8.94*7.3mm RoHS; MF: HRO Electronics Co., Ltd.; SnapEDA_Link: https://www.snapeda.com/parts/TYPE-C-31-M-12/HRO+Electronics+Co.%252C+Ltd./view-part/?ref=snap; Package: Package; Value: *; MP: TYPE-C-31-M-12; Check_prices: https://www.snapeda.com/parts/TYPE-C-31-M-12/HRO+Electronics+Co.%252C+Ltd./view-part/?ref=eda
J2 = SM04B-SRSS-TB(LF)(SN): Connector Header Surface Mount, Right Angle 4 position 0.039 (1.00mm); MF: JST Sales; SnapEDA_Link: https://www.snapeda.com/parts/SM04B-SRSS-TB(LF)(SN)/JST/view-part/?ref=snap; Package: None; Value: *; MP: SM04B-SRSS-TB(LF)(SN); Check_prices: https://www.snapeda.com/parts/SM04B-SRSS-TB(LF)(SN)/JST/view-part/?ref=eda
J3 = XT30PW-M: Socket; DC supply; XT30; male; PIN: 2; on PCBs; THT; Colour: yellow; MF: AMASS; SnapEDA_Link: https://www.snapeda.com/parts/XT30PW-M/AMASS/view-part/?ref=snap; Package: None; Value: *; MP: XT30PW-M; Check_prices: https://www.snapeda.com/parts/XT30PW-M/AMASS/view-part/?ref=eda
R3 R4 = CMP-02407-011165-1: RES SMD 100 OHM 1% 1/8W 0603; Temperature Coefficient: 25ppm/°C; Resistance: 5.1kR; Power Rating: 125mW; Tolerance: 0.1%; Voltage Rating: 75V; Length: 1.55mm; Case Code (Imperial): 0603; Case/Package: 0603; Construction: Rectangular; Package Quantity: 1000; Number of Terminations: 2; Termination: SMD/SMT; Resistor Type: Thin Film; Features: Automotive AEC-Q200; Series: MCT 0603 - Precision; Max Operating Temperature: 155°C; Depth: 0.85mm; Max Power Dissipation: 125mW; Min Operating Temperature: -55°C; Width: 0.033inch; Case Code (Metric): 1608; Packaging: Tape and Reel; Weight: 6.7E-05oz; Military Standard: Not; Height: 0.022inch
R5 R7 = CMP-02407-011165-1: RES SMD 100 OHM 1% 1/8W 0603; Temperature Coefficient: 25ppm/°C; Resistance: 22R; Power Rating: 125mW; Tolerance: 0.1%; Voltage Rating: 75V; Length: 1.55mm; Case Code (Imperial): 0603; Case/Package: 0603; Construction: Rectangular; Package Quantity: 1000; Number of Terminations: 2; Termination: SMD/SMT; Resistor Type: Thin Film; Features: Automotive AEC-Q200; Series: MCT 0603 - Precision; Max Operating Temperature: 155°C; Depth: 0.85mm; Max Power Dissipation: 125mW; Min Operating Temperature: -55°C; Width: 0.033inch; Case Code (Metric): 1608; Packaging: Tape and Reel; Weight: 6.7E-05oz; Military Standard: Not; Height: 0.022inch
R6 = CMP-02407-011165-1: as R25 on sheet Pyros; Length: 1.55mm; Case Code (Imperial): 0603; Case/Package: 0603; Construction: Rectangular; Package Quantity: 1000; Number of Terminations: 2; Termination: SMD/SMT; Resistor Type: Thin Film; Features: Automotive AEC-Q200; Series: MCT 0603 - Precision; Max Operating Temperature: 155°C; Depth: 0.85mm; Max Power Dissipation: 125mW; Min Operating Temperature: -55°C; Width: 0.033inch; Case Code (Metric): 1608; Packaging: Tape and Reel; Weight: 6.7E-05oz; Military Standard: Not; Height: 0.022inch
R8 = CMP-02407-011165-1: RES SMD 100 OHM 1% 1/8W 0603; Temperature Coefficient: 25ppm/°C; Resistance: 47kR; Power Rating: 125mW; Tolerance: 0.1%; Voltage Rating: 75V; Length: 1.55mm; Case Code (Imperial): 0603; Case/Package: 0603; Construction: Rectangular; Package Quantity: 1000; Number of Terminations: 2; Termination: SMD/SMT; Resistor Type: Thin Film; Features: Automotive AEC-Q200; Series: MCT 0603 - Precision; Max Operating Temperature: 155°C; Depth: 0.85mm; Max Power Dissipation: 125mW; Min Operating Temperature: -55°C; Width: 0.033inch; Case Code (Metric): 1608; Packaging: Tape and Reel; Weight: 6.7E-05oz; Military Standard: Not; Height: 0.022inch
R9 = CMP-02407-011165-1: RES SMD 100 OHM 1% 1/8W 0603; Temperature Coefficient: 25ppm/°C; Resistance: 100kR; Power Rating: 125mW; Tolerance: 0.1%; Voltage Rating: 75V; Length: 1.55mm; Case Code (Imperial): 0603; Case/Package: 0603; Construction: Rectangular; Package Quantity: 1000; Number of Terminations: 2; Termination: SMD/SMT; Resistor Type: Thin Film; Features: Automotive AEC-Q200; Series: MCT 0603 - Precision; Max Operating Temperature: 155°C; Depth: 0.85mm; Max Power Dissipation: 125mW; Min Operating Temperature: -55°C; Width: 0.033inch; Case Code (Metric): 1608; Packaging: Tape and Reel; Weight: 6.7E-05oz; Military Standard: Not; Height: 0.022inch
U1 U2 = AMS1117-5.0: 1A LOW DROPOUT VOLTAGE REGULATOR; MF: ams; MP: AMS1117-5.0; Package: SOT-223 Seeed Technology; SnapEDA_Link: https://www.snapeda.com/parts/AMS1117-5.0/ams/view-part/?ref=snap; Check_prices: https://www.snapeda.com/parts/AMS1117-5.0/ams/view-part/?ref=eda; Availability: Not in stock; Value: *; Price: None

## Sheet Sensors.SchDoc
size A; SheetNumber: 4; SheetTotal: 7
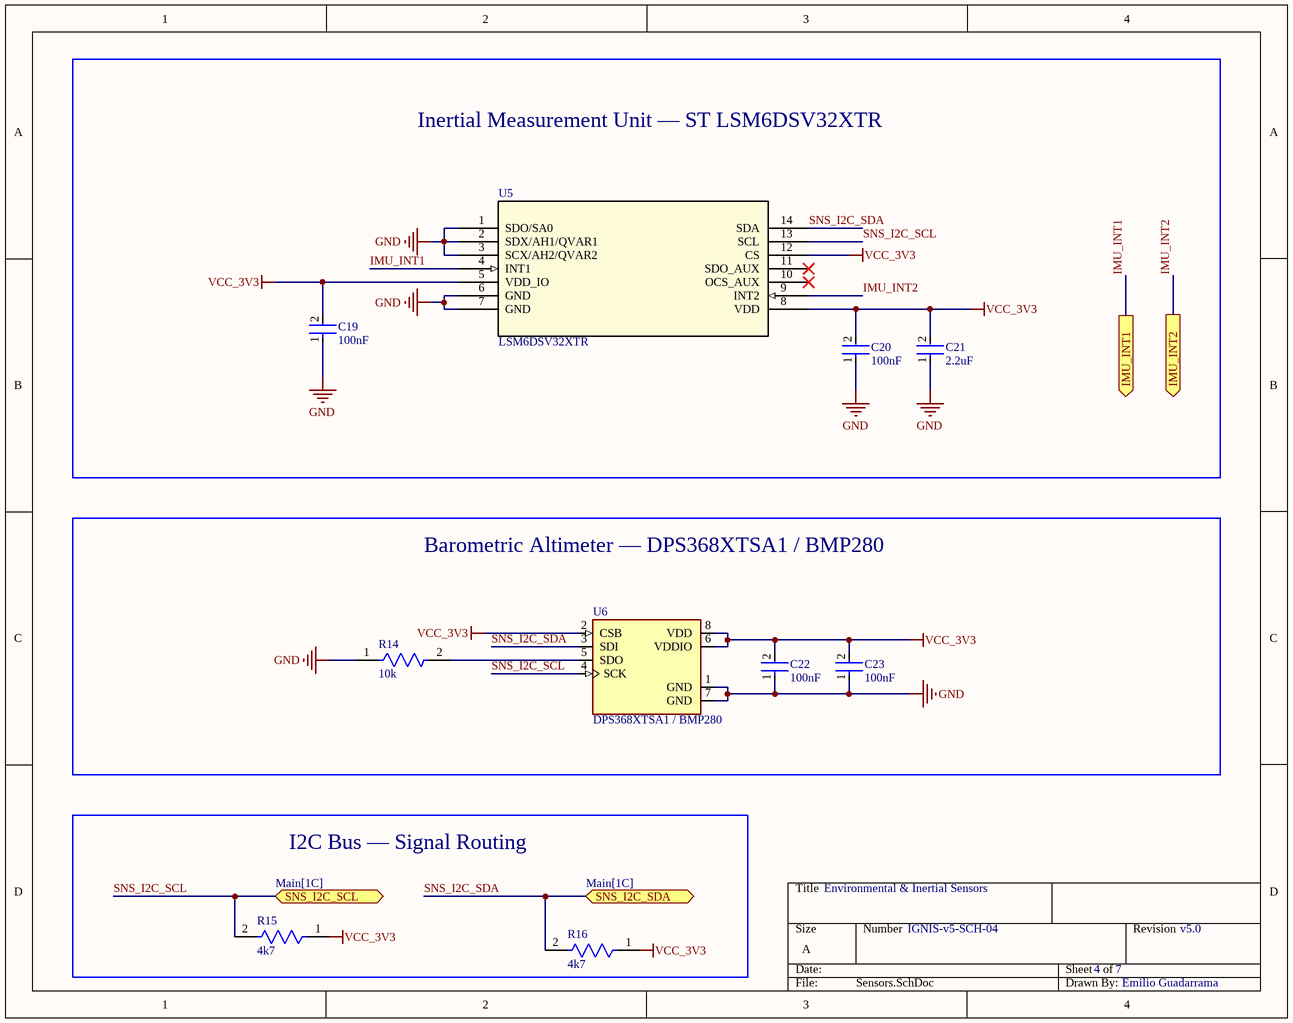
[diagram p6: Sensors.SchDoc]

### Parts
C19  100nF  [FP-C0805C-DN-MFG]
C20  100nF  [FP-C0805C-DN-MFG]
C21  2.2uF  [FP-C0805C-DN-MFG]
C22  100nF  [FP-C0805C-DN-MFG]
C23  100nF  [FP-C0805C-DN-MFG]
R14  10k  [FP-MCT0603-IPC_A]
R15  4k7  [FP-MCT0603-IPC_A]
R16  4k7  [FP-MCT0603-IPC_A]
U5  LSM6DSV32XTR  [LGA-14L_2p5X3p0X0p86_STM]
U6  DPS368XTSA1 / BMP280  [XDCR_BMP280]

### Blocks framed on the sheet
Inertial Measurement Unit — ST LSM6DSV32XTR: C19-C21 U5
Barometric Altimeter — DPS368XTSA1 / BMP280: C22 C23 R14 U6
I2C Bus — Signal Routing: R15 R16

### Ports
IMU_INT1 (out), IMU_INT2 (out), SNS_I2C_SCL (bidir, see Main[1C]), SNS_I2C_SDA (bidir, see Main[1C])

### Nets
GND: C19.1 C20.1 C21.1 C22.1 C23.1 R14.1 U5.1(SDO/SA0) U5.2(SDX/AH1/QVAR1) U5.3(SCX/AH2/QVAR2) U5.6(GND) U5.7(GND) U6.1(GND) U6.7(GND)
VCC_3V3: C19.2 C20.2 C21.2 C22.2 C23.2 R15.1 R16.1 U5.5(VDD_IO) U5.8(VDD) U5.12(CS) U6.2(CSB) U6.6(VDDIO) U6.8(VDD)
IMU_INT1: U5.4(INT1) ; port IMU_INT1
IMU_INT2: U5.9(INT2) ; port IMU_INT2
SNS_I2C_SCL: R15.2 U5.13(SCL) U6.4(SCK) ; port SNS_I2C_SCL
SNS_I2C_SDA: R16.2 U5.14(SDA) U6.3(SDI) ; port SNS_I2C_SDA
NetR14_2: R14.2 U6.5(SDO)

Not connected (* = marked no-connect by the designer): U5 10(OCS_AUX)* 11(SDO_AUX)*

### Notes on the sheet
- Environmental & Inertial Sensors
- IGNIS-v5-SCH-04
- 4
- 7
- v5.0
- Emilio Guadarrama

### Library data of the parts
C19 C20 = CMP-2007-00279-2: CAP CER 0.1UF 50V X7R 0805; Manufacturer Part Number: C0805C104K5RACTU; Manufacturer: KEMET; Tolerance: 0.1; Temperature Coefficient: 30ppm/°C; Material: Ceramic; Capacitance: 0.10 μF; Device Class L2: Capacitors; Temperature Range Low: -55°C; Voltage Rating: 50 V; Digikey Description: CAP CER 0.1UF 50V X7R 0805; Value: 100 nF; Category: Cap; ComponentLink2Description: Datasheet; Octopart: https://octopart.com/c0805c104k5ractu-kemet-143926; RoHS: TRUE; ComponentLink2URL: https://content.kemet.com/datasheets/KEM_C1003_C0G_SMD.pdf; Temperature Characteristic: X7R; Temperature: -55°C to +125°C; Height: 0.88mm; Temperature Range High: +125°C; Device Class L1: Passive Components; Automotive: No; Lead Free: Yes; Ipc Land Pattern Name: CAPC200125X78; Device Class L3: Ceramic Capacitors; Mouser Description: Cap Ceramic 0.1uF 50V X7R 10% SMD 2.0 x 1.2 mm 125 C Paper T/R; Package: C0805C-DN
C21 = CMP-2007-00279-2: CAP CER 0.1UF 50V X7R 0805; Manufacturer Part Number: C0805C104K5RACTU; Manufacturer: KEMET; Value: 100 nF; Tolerance: 0.1; Temperature Coefficient: 30ppm/°C; Material: Ceramic; Capacitance: 0.10 μF; Device Class L2: Capacitors; Temperature Range Low: -55°C; Voltage Rating: 50 V; Digikey Description: CAP CER 0.1UF 50V X7R 0805; Category: Cap; ComponentLink2Description: Datasheet; Octopart: https://octopart.com/c0805c104k5ractu-kemet-143926; RoHS: TRUE; ComponentLink2URL: https://content.kemet.com/datasheets/KEM_C1003_C0G_SMD.pdf; Temperature Characteristic: X7R; Temperature: -55°C to +125°C; Height: 0.88mm; Temperature Range High: +125°C; Device Class L1: Passive Components; Automotive: No; Lead Free: Yes; Ipc Land Pattern Name: CAPC200125X78; Device Class L3: Ceramic Capacitors; Mouser Description: Cap Ceramic 0.1uF 50V X7R 10% SMD 2.0 x 1.2 mm 125 C Paper T/R; Package: C0805C-DN
C22 C23 = CMP-2007-00279-2: as C24 on sheet Storage; Device Class L2: Capacitors; Temperature Range Low: -55°C; Voltage Rating: 50 V; Digikey Description: CAP CER 0.1UF 50V X7R 0805; Value: 100 nF; Category: Cap; ComponentLink2Description: Datasheet; Octopart: https://octopart.com/c0805c104k5ractu-kemet-143926; RoHS: TRUE; ComponentLink2URL: https://content.kemet.com/datasheets/KEM_C1003_C0G_SMD.pdf; Temperature Characteristic: X7R; Temperature: -55°C to +125°C; Height: 0.88mm; Temperature Range High: +125°C; Device Class L1: Passive Components; Automotive: No; Lead Free: Yes; Ipc Land Pattern Name: CAPC200125X78; Device Class L3: Ceramic Capacitors; Mouser Description: Cap Ceramic 0.1uF 50V X7R 10% SMD 2.0 x 1.2 mm 125 C Paper T/R; Capacitance: 100 nF; Package: C0805C-DN
R14-R16 = CMP-02407-011165-1: RES SMD 100 OHM 1% 1/8W 0603; Temperature Coefficient: 25ppm/°C; Resistance: 4.7kR; Power Rating: 125mW; Tolerance: 0.1%; Voltage Rating: 75V; Length: 1.55mm; Case Code (Imperial): 0603; Case/Package: 0603; Construction: Rectangular; Package Quantity: 1000; Number of Terminations: 2; Termination: SMD/SMT; Resistor Type: Thin Film; Features: Automotive AEC-Q200; Series: MCT 0603 - Precision; Max Operating Temperature: 155°C; Depth: 0.85mm; Max Power Dissipation: 125mW; Min Operating Temperature: -55°C; Width: 0.033inch; Case Code (Metric): 1608; Packaging: Tape and Reel; Weight: 6.7E-05oz; Military Standard: Not; Height: 0.022inch
U5 = LSM6DSV32XTR: 6-axis IMU (inertial measurement unit) with 32 g accelerometer and embedded sensor fusion, AI, Qvar for high-end applications; Manufacturer_Name: STMicroelectronics; Type: Motion Sensors; Copyright: Copyright (C) 2026 Ultra Librarian. All rights reserved.; Manufacturer_Part_Number: LSM6DSV32XTR; RefDes: RefDes
U6 = BMP280: BMP280 Absolute Barometric Pressure Sensor for Battery Powered Devices 2 x 2.5mm; Package: None; Availability: Unavailable; MP: BMP280; Value: *; Price: None

## Nets that join several sheets
GND: Main (9 pins), Pyros (14 pins), Storage (C24.2 C25.2 R17.1), Indicators (11 pins), RF_LoRa_&_GPS (23 pins), Power (23 pins), Sensors (13 pins)
VBAT: Pyros (Q1.3 Q4.3 U7.4 U9.4), Power (5 pins)
VCC_3V3: Main (5 pins), Pyros (U8.4 U10.4), Storage (7 pins), Indicators (9 pins), RF_LoRa_&_GPS (10 pins), Power (5 pins), Sensors (13 pins)
VCC_5V: Indicators (D4.C), Power (7 pins)
BUZZER: Main (MCU1.22), Indicators (Q.1 R24.1)
GPS_UART_RX: Main (MCU1.11), RF_LoRa_&_GPS (R11.2)
GPS_UART_TX: Main (MCU1.10), RF_LoRa_&_GPS (R10.2)
PYRO_CH1_CONT: Main (MCU1.39), Pyros (R35.1 U10.3)
PYRO_CH1_GATE: Main (MCU1.4), Pyros (U9.1)
PYRO_CH2_CONT: Main (MCU1.38), Pyros (R31.1 U8.3)
PYRO_CH2_GATE: Main (MCU1.5), Pyros (U7.1)
RFM95W_CS: Main (MCU1.18), RF_LoRa_&_GPS (U4.5)
RFM95W_INT: Main (MCU1.7), RF_LoRa_&_GPS (U4.14)
RFM95W_RESET: Main (MCU1.12), RF_LoRa_&_GPS (U4.6)
RXD0: Main (MCU1.36), Power (J2.3)
SD_DETECT: Main (MCU1.35), Storage (R17.2)
SNS_I2C_SCL: Main (MCU1.31), Sensors (R15.2 U5.13 U6.4)
SNS_I2C_SDA: Main (MCU1.23), Sensors (R16.2 U5.14 U6.3)
SNS_SPI_MISO: Main (MCU1.21), Storage (R19.2), RF_LoRa_&_GPS (U4.2)
SNS_SPI_MOSI: Main (MCU1.19), Storage (R20.2), RF_LoRa_&_GPS (U4.3)
SNS_SPI_SCK: Main (MCU1.20), Storage (R21.2), RF_LoRa_&_GPS (U4.4)
TXD0: Main (MCU1.37), Power (J2.2)
USB2_N: Main (MCU1.13), Power (R7.1)
USB2_P: Main (MCU1.14), Power (R5.1)
VBAT_MON: Main (MCU1.15), Power (C13.1 R8.1 R9.1)
WS2812B_DATA: Main (MCU1.6), Indicators (R23.1)